# Altium schematic sheet 1_STM32_Tutorial-Power.SchDoc: Power
size A4; SheetNumber: 2; SheetTotal: 4
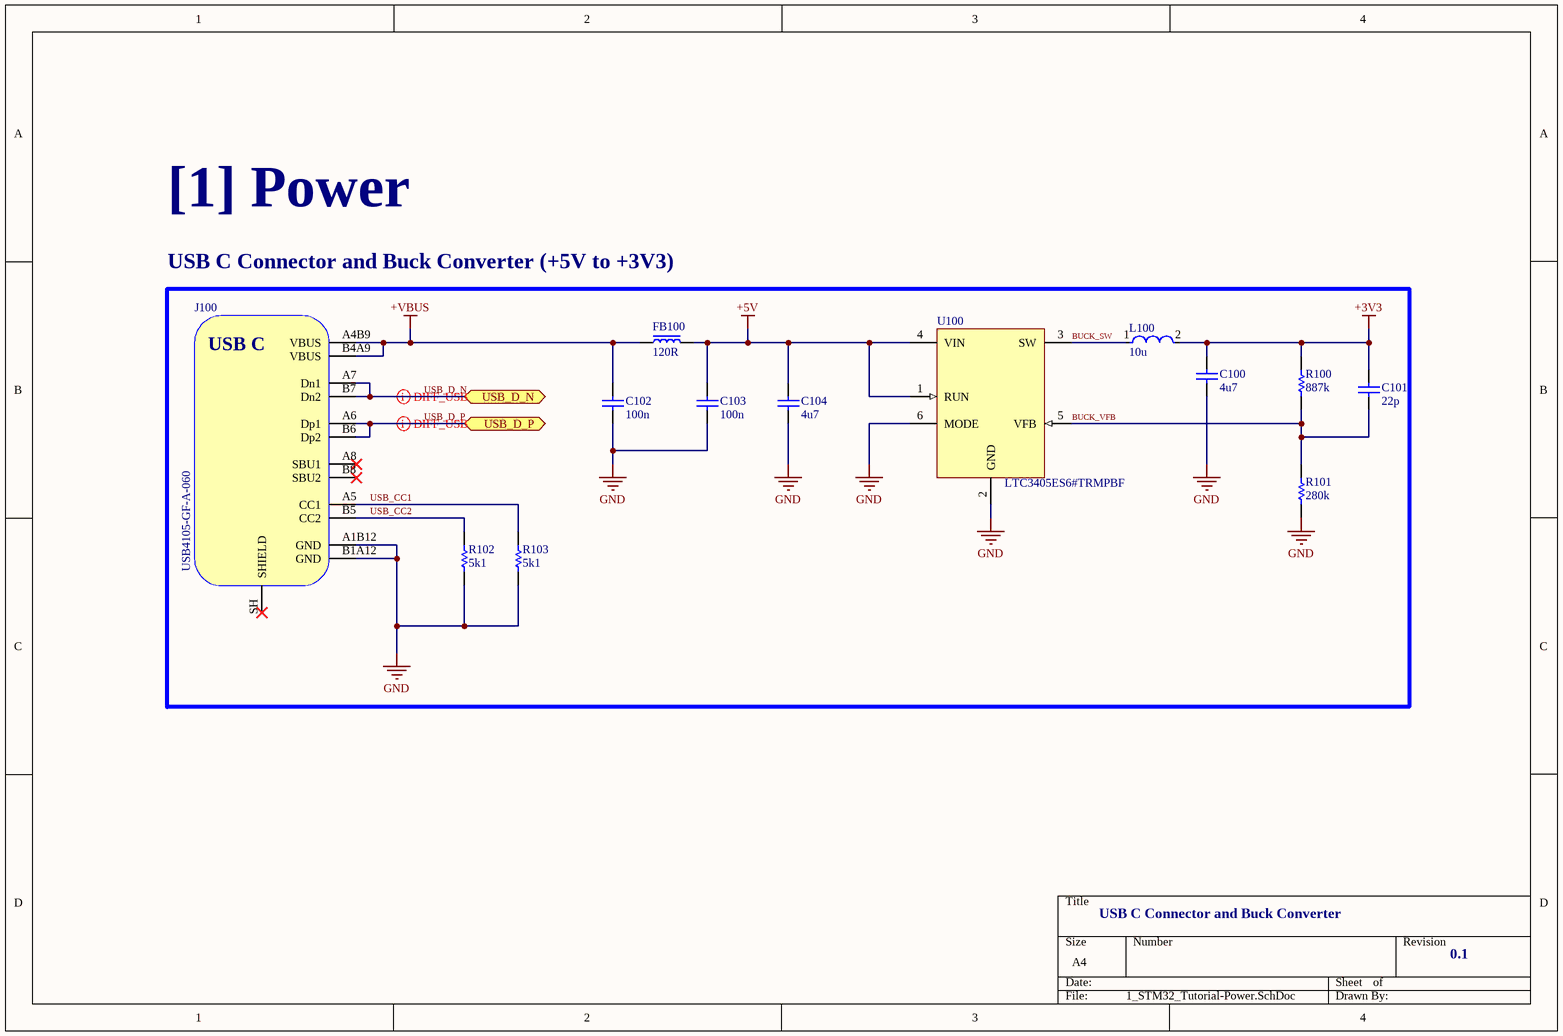
[diagram p0: 1_STM32_Tutorial-Power.SchDoc]

## Parts
C100  4u7  [CAP_0805]
C101  22p  [CAP_0603]
C102  100n  [CAP_0603]
C103  100n  [CAP_0603]
C104  4u7  [CAP_0805]
FB100  120R  [KMZ1608DHR121CTDH5]
J100  USB4105-GF-A-060  [USB4105-GF-A-060]
L100  10u  [FP-NRH2412-MFG]
R100  887k  [RES_0603]
R101  280k  [RES_0603]
R102  5k1  [RES_0603]
R103  5k1  [RES_0603]
U100  LTC3405ES6#TRMPBF  [SOT-23-6]

## Blocks framed on the sheet
USB C Connector and Buck Converter (+5V to +3V3): C100-C104 FB100 J100 L100 R100-R103 U100

## Ports
USB_D_N (bidir, see 0_STM32_Tutorial-Overview[2B], 2_STM32_Tutorial-MCU[2B]), USB_D_P (bidir, see 0_STM32_Tutorial-Overview[2B], 2_STM32_Tutorial-MCU[2B])

## Nets
+3V3: C100.1 C101.2 L100.2 R100.2
+5V: C103.2 C104.1 FB100.2 U100.1(RUN) U100.4(VIN)
+VBUS: C102.2 FB100.1 J100.A4B9(VBUS) J100.B4A9(VBUS)
GND: C100.2 C102.1 C103.1 C104.2 J100.A1B12(GND) J100.B1A12(GND) R101.1 R102.1 R103.1 U100.2(GND) U100.6(MODE)
BUCK_SW: L100.1 U100.3(SW)
BUCK_VFB: C101.1 R100.1 R101.2 U100.5(VFB)
USB_CC1: J100.A5(CC1) R103.2
USB_CC2: J100.B5(CC2) R102.2
USB_D_N: J100.A7(Dn1) J100.B7(Dn2) ; port USB_D_N
USB_D_P: J100.A6(Dp1) J100.B6(Dp2) ; port USB_D_P

Not connected (* = marked no-connect by the designer): J100 A8(SBU1)* B8(SBU2)* SH(SHIELD)*

## Layout directives
differential pair; differential pair class USB: USB_D_N, USB_D_P

## Notes on the sheet
- [1] Power
- USB C Connector and Buck Converter
- 0.1
- (in symbol USB4105-GF-A-060) USB C

## Library data of the parts
C100 C104 = CAP_0805: Capacitor SMD 0805 Generic; Manufacturer: *; Manufacturer Part Number: *; Tolerance: *; Package Size: *; LCSC Part Number: *
C101-C103 = CAP_0603: Capacitor SMD 0603 Generic; Manufacturer: *; Manufacturer Part Number: *; Tolerance: *; Package Size: *; LCSC Part Number: *
FB100 = KMZ1608DHR121CTDH5: Ferrite Beads 120MHz 0.3Ohm 25% 1608 AEC-Q200; Manufacturer: *; Manufacturer Part Number: *; LCSC Part Number: *
J100 = USB4105-GF-A-060: USB Connector Type C SMT 12 Pin; Manufacturer: *; Manufacturer Part Number: *; LCSC Part Number: *
L100 = CMP-14484-000582-1: NRH2412T100MNGH - Shielded Wirewound Inductor 10uH 20% 0.51A 0.72Ω SMD; DC Resistance (DCR): 600mR; Current Rating: 450mA; Saturation Current: 810mA; Core Material: Ferrite; Test Frequency: 100kHz; Self Resonant Frequency: 29MHz; Termination: SMD/SMT; Shielding: Shielded; Height - Seated (Max): 0.047inch; Case/Package: Nonstandard; Tolerance: 20%; Height: 1.2mm; Package Quantity: 2500; Mount: Surface Mount; Min Operating Temperature: -25°C; Inductance: 10uH; Width: 0.095inch; Length: 0.095inch; RoHS Compliant: Yes; Max DC Current: 810mA; Packaging: Tape and Reel; Max Operating Temperature: 120°C; Halogen Free: Halogen Free
R100-R103 = RES_0603: Resistor SMD 0603 Generic; Manufacturer: *; Manufacturer Part Number: *; Tolerance: *; Package Size: *; LCSC Part Number: *
U100 = LTC3405ES6#TRMPBF: 1.5MHz, 300mA Synchronous Step-Down Regulator in ThinSOT; Manufacturer: Analog Devices; Manufacturer Part Number: LTC3405ES6#TRMPBF